# Altium schematic sheet Driver Borad.schdoc
size 292 x 204 mm
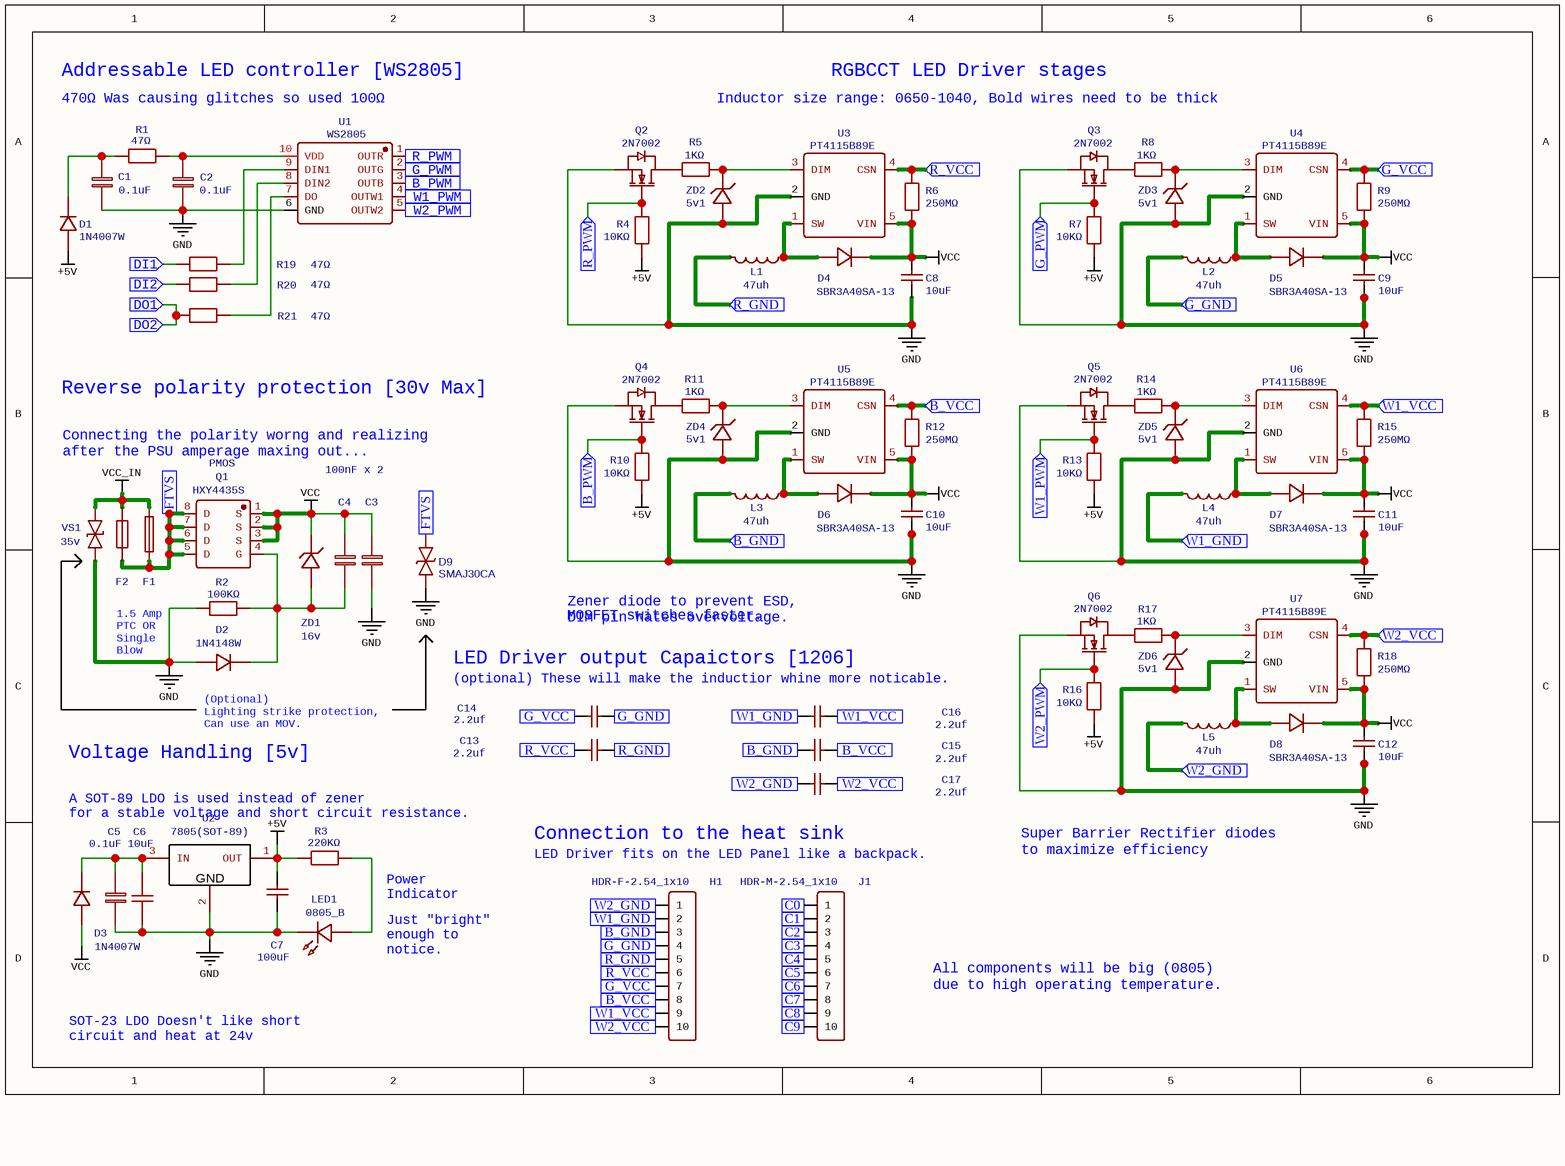
[diagram p0: Driver Borad.schdoc]

## Parts
C1  0.1uF  [C0805]
C2  0.1uF  [C0805]
C3  100nF  [C0805]  (value not drawn)
C4  100nF  [C0805]  (value not drawn)
C5  0.1uF  [C0805]
C6  10uF  [C1206]
C7  100uF  [C1206]
C8  10uF  [C1210]
C9  10uF  [C1210]
C10  10uF  [C1210]
C11  10uF  [C1210]
C12  10uF  [C1210]
C13  2.2uf  [C1206]
C14  2.2uf  [C1206]
C15  2.2uf  [C1206]
C16  2.2uf  [C1206]
C17  2.2uf  [C1206]
D1  1N4007W  [SOD-123_L2.8-W1.8-LS3.7-RD]
D2  1N4148W  [SOD-123FL_L2.6-W1.6-LS3.4-RD]
D3  1N4007W  [SOD-123_L2.8-W1.8-LS3.7-RD]
D4  SBR3A40SA-13  [SMA_L4.4-W2.8-LS5.4-RD]
D5  SBR3A40SA-13  [SMA_L4.4-W2.8-LS5.4-RD]
D6  SBR3A40SA-13  [SMA_L4.4-W2.8-LS5.4-RD]
D7  SBR3A40SA-13  [SMA_L4.4-W2.8-LS5.4-RD]
D8  SBR3A40SA-13  [SMA_L4.4-W2.8-LS5.4-RD]
D9  SMAJ30CA  [SMA_L4.4-W2.8-LS5.1-BI]
F1  3A PTC  [R1206]  (value not drawn)
F2  0ZCG0050FF2C  [F1812]  (value not drawn)
H1  HDR-F-2.54_1x10  [HDR-F-2.54_1X10]
J1  HDR-M-2.54_1x10  [HDR-M-2.54_1X10]
L1  47uh  [IND-SMD_L7.2-W6.6_GPSR07X0]
L2  47uh  [IND-SMD_L7.2-W6.6_GPSR07X0]
L3  47uh  [IND-SMD_L7.2-W6.6_GPSR07X0]
L4  47uh  [IND-SMD_L7.2-W6.6_GPSR07X0]
L5  47uh  [IND-SMD_L7.2-W6.6_GPSR07X0]
LED1  0805_B  [LED0805_BLUE]
Q1  HXY4435S  [SOP-8_L4.9-W3.9-P1.27-LS6.0-BL]
Q2  2N7002  [SOT-23_L2.9-W1.3-P0.95-LS2.4-BR]
Q3  2N7002  [SOT-23_L2.9-W1.3-P0.95-LS2.4-BR]
Q4  2N7002  [SOT-23_L2.9-W1.3-P0.95-LS2.4-BR]
Q5  2N7002  [SOT-23_L2.9-W1.3-P0.95-LS2.4-BR]
Q6  2N7002  [SOT-23_L2.9-W1.3-P0.95-LS2.4-BR]
R1  47Ω  [R0805]
R2  100KΩ  [R0805]
R3  220KΩ  [R0603]
R4  10KΩ  [R0805]
R5  1KΩ  [R0805]
R6  250MΩ  [R1206]
R7  10KΩ  [R0805]
R8  1KΩ  [R0805]
R9  250MΩ  [R1206]
R10  10KΩ  [R0805]
R11  1KΩ  [R0805]
R12  250MΩ  [R1206]
R13  10KΩ  [R0805]
R14  1KΩ  [R0805]
R15  250MΩ  [R1206]
R16  10KΩ  [R0805]
R17  1KΩ  [R0805]
R18  250MΩ  [R1206]
R19  47Ω  [R0805]
R20  47Ω  [R0805]
R21  47Ω  [R0805]
U1  WS2805  [SOP-10_L4.9-W3.9-P1.00-LS6.0-BL]
U2  7805(SOT-89)  [SOT-89-3_L4.5-W2.5-P1.50-LS4.2-BR]
U3  PT4115B89E  [SOT-89-5_L4.5-W2.5-P1.50-LS4.5-BR]
U4  PT4115B89E  [SOT-89-5_L4.5-W2.5-P1.50-LS4.5-BR]
U5  PT4115B89E  [SOT-89-5_L4.5-W2.5-P1.50-LS4.5-BR]
U6  PT4115B89E  [SOT-89-5_L4.5-W2.5-P1.50-LS4.5-BR]
U7  PT4115B89E  [SOT-89-5_L4.5-W2.5-P1.50-LS4.5-BR]
VS1  35v  [SMB_L4.6-W3.6-LS5.3-BI]
ZD1  16v  [SOD-123_L2.8-W1.8-LS3.7-RD]
ZD2  5v1  [SOD-123_L2.8-W1.8-LS3.7-RD]
ZD3  5v1  [SOD-123_L2.8-W1.8-LS3.7-RD]
ZD4  5v1  [SOD-123_L2.8-W1.8-LS3.7-RD]
ZD5  5v1  [SOD-123_L2.8-W1.8-LS3.7-RD]
ZD6  5v1  [SOD-123_L2.8-W1.8-LS3.7-RD]

## Ports
B_GND (in), B_PWM (in), B_VCC (in), C0 (in), C1 (in), C2 (in), C3 (in), C4 (in), C5 (in), C6 (in), C7 (in), C8 (in), C9 (in), DI1 (in), DI2 (in), DO1 (in), DO2 (in), FTVS (in), G_GND (in), G_PWM (in), G_VCC (in), R_GND (in), R_PWM (in), R_VCC (in), W1_GND (in), W1_PWM (in), W1_VCC (in), W2_GND (in), W2_PWM (in), W2_VCC (in)

## Nets
+5V: C7.2 D1.2 R3.1 R4.2 R7.2 R10.2 R13.2 R16.2 U2.1(OUT)
GND: C1.2 C2.2 C3.2 C5.2 C6.1 C7.1 C8.2 C9.2 C10.2 C11.2 C12.2 D2.2 D9.1 LED1.2 Q2.2(S) Q3.2(S) Q4.2(S) Q5.2(S) Q6.2(S) R2.1 U1.6(GND) U2.2(GND) U3.2(GND) U4.2(GND) U5.2(GND) U6.2(GND) U7.2(GND) VS1.1 ZD2.2(A) ZD3.2(A) ZD4.2(A) ZD5.2(A) ZD6.2(A)
VCC: C3.1 C4.1 C8.1 C9.1 C10.1 C11.1 C12.1 D3.2 D4.1(K) D5.1(K) D6.1(K) D7.1(K) D8.1(K) Q1.1(S) Q1.2(S) Q1.3(S) R6.2 R9.2 R12.2 R15.2 R18.2 U3.5(VIN) U4.5(VIN) U5.5(VIN) U6.5(VIN) U7.5(VIN) ZD1.1(C)
VCC_IN: F1.1 F2.2 VS1.2
B_GND: C15.2 H1.3 L3.2 ; port B_GND
B_PWM: Q4.1(G) R10.1 U1.3(OUTB) ; port B_PWM
B_VCC: C15.1 H1.8 R12.1 U5.4(CSN) ; port B_VCC
C0: J1.1 ; port C0
C1: J1.2 ; port C1
C2: J1.3 ; port C2
C3: J1.4 ; port C3
C4: J1.5 ; port C4
C5: J1.6 ; port C5
C6: J1.7 ; port C6
C7: J1.8 ; port C7
C8: J1.9 ; port C8
C9: J1.10 ; port C9
DI1: R19.2 ; port DI1
DI2: R20.2 ; port DI2
DO1: R21.2 ; port DO2, port DO1
FTVS: D9.2 F1.2 F2.1 Q1.5(D) Q1.6(D) Q1.7(D) Q1.8(D) ; port FTVS
G_GND: C14.1 H1.4 L2.2 ; port G_GND
G_PWM: Q3.1(G) R7.1 U1.2(OUTG) ; port G_PWM
G_VCC: C14.2 H1.7 R9.1 U4.4(CSN) ; port G_VCC
R_GND: C13.1 H1.5 L1.2 ; port R_GND
R_PWM: Q2.1(G) R4.1 U1.1(OUTR) ; port R_PWM
R_VCC: C13.2 H1.6 R6.1 U3.4(CSN) ; port R_VCC
W1_GND: C16.2 H1.2 L4.2 ; port W1_GND
W1_PWM: Q5.1(G) R13.1 U1.4(OUTW1) ; port W1_PWM
W1_VCC: C16.1 H1.9 R15.1 U6.4(CSN) ; port W1_VCC
W2_GND: C17.2 H1.1 L5.2 ; port W2_GND
W2_PWM: Q6.1(G) R16.1 U1.5(OUTW2) ; port W2_PWM
W2_VCC: C17.1 H1.10 R18.1 U7.4(CSN) ; port W2_VCC
NetC1_1: C1.1 D1.1 R1.1
NetC2_1: C2.1 R1.2 U1.10(VDD)
NetC4_2: C4.2 D2.1 Q1.4(G) R2.2 ZD1.2(A)
NetC5_1: C5.1 C6.2 D3.1 U2.3(IN)
NetD4_2: D4.2(A) L1.1 U3.1(SW)
NetD5_2: D5.2(A) L2.1 U4.1(SW)
NetD6_2: D6.2(A) L3.1 U5.1(SW)
NetD7_2: D7.2(A) L4.1 U6.1(SW)
NetD8_2: D8.2(A) L5.1 U7.1(SW)
NetLED1_1: LED1.1 R3.2
NetQ2_3: Q2.3(D) R5.1
NetQ3_3: Q3.3(D) R8.1
NetQ4_3: Q4.3(D) R11.1
NetQ5_3: Q5.3(D) R14.1
NetQ6_3: Q6.3(D) R17.1
NetR5_2: R5.2 U3.3(DIM) ZD2.1(C)
NetR8_2: R8.2 U4.3(DIM) ZD3.1(C)
NetR11_2: R11.2 U5.3(DIM) ZD4.1(C)
NetR14_2: R14.2 U6.3(DIM) ZD5.1(C)
NetR17_2: R17.2 U7.3(DIM) ZD6.1(C)
NetR19_1: R19.1 U1.9(DIN1)
NetR20_1: R20.1 U1.8(DIN2)
NetR21_1: R21.1 U1.7(DO)

## Notes on the sheet
- 470Ω Was causing glitches so used 100Ω
- Addressable LED controller [WS2805]
- Inductor size range: 0650-1040, Bold wires need to be thick
- RGBCCT LED Driver stages
- Connecting the polarity worng and realizing
  after the PSU amperage maxing out...
- Reverse polarity protection [30v Max]
- (near Q1) PMOS
- 100nF x 2
- 1.5 Amp
  PTC OR
  Single
  Blow
- MOSFET switches faster.
- (near C14) Zener diode to prevent ESD,
  DIM pin hates overvoltage.
- (Optional)
  Lighting strike protection,
  Can use an MOV.
- (optional) These will make the inductior whine more noticable.
- LED Driver output Capaictors [1206]
- Voltage Handling [5v]
- A SOT-89 LDO is used instead of zener
  for a stable voltage and short circuit resistance.
- Connection to the heat sink
- Super Barrier Rectifier diodes
  to maximize efficiency
- (near U2) GND
- Just "bright"
  enough to
  notice.
- Power
  Indicator
- LED Driver fits on the LED Panel like a backpack.
- All components will be big (0805)
  due to high operating temperature.
- SOT-23 LDO Doesn't like short
  circuit and heat at 24v

## Library data of the parts
C1 C2 C5 = 0.1uF: Manufacturer Part: CL21B104KCFNNNE; Manufacturer: SAMSUNG(三星); nameAlias: Value(F); Contributor: LCEDA_Lib; Supplier Part: C28233; Supplier: LCSC; spicePre: C; spiceSymbolName: C_0603_EU
C3 C4 = 100nF: Manufacturer Part: CL21B104KCFNNNE; Manufacturer: SAMSUNG(三星); nameAlias: Value(F); Contributor: LCEDA_Lib; Supplier Part: C28233; Supplier: LCSC; spicePre: C; spiceSymbolName: C_0603_EU
C6 = 10uF: Manufacturer: SAMSUNG(三星); Manufacturer Part: CL31A106KBHNNNE; nameAlias: Value; Supplier: LCSC; Supplier Part: C13585; JLCPCB Part Class: Extended Part; spicePre: C; spiceSymbolName: CL31B105KCHNNNE
C7 = 100uF: Manufacturer Part: CL31A106KBHNNNE; Manufacturer: SAMSUNG(三星); nameAlias: Value; Supplier: LCSC; Supplier Part: C13585; JLCPCB Part Class: Basic Part; link: https://lcsc.com/eda_search?q=C13585&%26type=1&ref=editor; spicePre: C; spiceSymbolName: CL31A106KBHNNNE
C8-C12 = 10uF: Manufacturer Part: CS3225X7R106K500NRL; Manufacturer: Samwha Capacitor; nameAlias: Value; Supplier: LCSC; Supplier Part: C2918502; JLCPCB Part Class: Extended Part; link: https://lcsc.com/eda_search?q=C13585&%26type=1&ref=editor; spicePre: C; spiceSymbolName: CL31A106KBHNNNE
C13-C17 = 2.2uf: Manufacturer Part: CL31A107MQHNNNE; Manufacturer: SAMSUNG(三星); nameAlias: Value; Supplier: LCSC; Supplier Part: C15008; JLCPCB Part Class: Basic Part; link: https://lcsc.com/eda_search?q=C13585&%26type=1&ref=editor; spicePre: C; spiceSymbolName: CL31A106KBHNNNE
D1 D3 = 1N4007W: Manufacturer: B ROCKET; Contributor: LCEDA_Lib; Supplier: LCSC; Supplier Part: C328592; Manufacturer Part: 1N4007W; spicePre: D; spiceSymbolName: 1N4007W
D2 = 1N4148W: Manufacturer: Tak Cheong; Contributor: LCEDA_Lib; Supplier: LCSC; Manufacturer Part: 1N4148W; Supplier Part: C129216; spicePre: D; spiceSymbolName: 1N4148W
D4-D8 = SBR3A40SA-13: Manufacturer: DIODES(美台); Supplier: LCSC; Manufacturer Part: SBR3A40SA-13; Supplier Part: C110516; JLCPCB Part Class: Extended Part; spicePre: D; spiceSymbolName: SBR3A40SA-13
D9 = SMAJ30CA: Manufacturer: GOODWORK(固得沃克); Contributor: LCSC; Supplier: LCSC; Supplier Part: C908828; Manufacturer Part: SMAJ30CA; JLCPCB Part Class: Extended Part; spicePre: D; spiceSymbolName: SMAJ30CA_C908828
F1 = 3A PTC: Manufacturer: TA-I Tech; Manufacturer Part: CFS12V3T3R00; Contributor: LCSC; Supplier: LCSC; Supplier Part: C163126; JLCPCB Part Class: Extended Part; spicePre: F; spiceSymbolName: 12H1300C
F2 = 0ZCG0050FF2C: Contributor: LCSC; Supplier: LCSC; Supplier Part: C9900006526; Manufacturer Part: 0ZCG0050FF2C; JLCPCB Part Class: Extended Part; spicePre: F; spiceSymbolName: 0ZCG0050FF2C
H1 = HDR-F-2.54_1x10: Contributor: LCEDA_Lib; Supplier Part: C35445; Supplier: LCSC; spicePre: H; spiceSymbolName: HDR-F-2.54_1x10
J1 = HDR-M-2.54_1x10: Contributor: LCEDA_Lib; Supplier Part: C57369; Supplier: LCSC; spicePre: J; spiceSymbolName: HDR-M-2.54_1x10
L1-L5 = 47uh: Manufacturer: cjiang(长江微电); Manufacturer Part: FXL0650-R68-M; nameAlias: Value; Contributor: lcsc; Supplier: LCSC; Supplier Part: C475519; JLCPCB Part Class: Extended Part; spicePre: L; spiceSymbolName: CYA0650-47UH
LED1 = 0805_B: Manufacturer: EVERLIGHT(台湾亿光); Manufacturer Part: 19-217/BHC-ZL1M2RY/3T; Contributor: LCEDA_01; Supplier Part: C72041; Supplier: LCSC; spicePre: L; spiceSymbolName: LED-0603_B
Q1 = HXY4435S: Manufacturer: HXY MOSFET(华轩阳电子); Contributor: lcsc; Supplier: LCSC; Supplier Part: C3033411; Manufacturer Part: HXY4435S; JLCPCB Part Class: Extended Part; spicePre: U; spiceSymbolName: HXY4435S
Q2-Q6 = 2N7002: Manufacturer: Nexperia; Manufacturer Part: 2N7002,215; Paste Type: expand; Contributor: LCEDA_Lib; Supplier: LCSC; image: //image.lceda.cn/szlcsc/C65189.jpg; Supplier Part: C65189; spicePre: Q; spiceSymbolName: 2N7002
R1 = 47Ω: Manufacturer Part: 0805W8J0103T5E; Manufacturer: UNI-ROYAL(Uniroyal Elec); nameAlias: Value(Ω); Contributor: LCEDA_Lib; Supplier Part: C25612; Supplier: LCSC; spicePre: R; spiceSymbolName: R_0603_EU
R2 = 100KΩ: Manufacturer Part: FRC0805J104 TS; Manufacturer: FOJAN(富捷); nameAlias: Value(Ω); Contributor: LCEDA_Lib; Supplier Part: C2907293; Supplier: LCSC; spicePre: R; spiceSymbolName: R_0603_EU
R3 = 220KΩ: Manufacturer Part: RC0603FR-07220KL; Manufacturer: YAGEO(国巨); nameAlias: Value(Ω); Contributor: LCEDA_Lib; Supplier Part: C123420; Supplier: LCSC; spicePre: R; spiceSymbolName: R_0402_EU
R4 R7 R10 R13 R16 = 10KΩ: Manufacturer Part: 0805W8J0103T5E; Manufacturer: UNI-ROYAL(Uniroyal Elec); nameAlias: Value(Ω); Contributor: LCEDA_Lib; Supplier Part: C25612; Supplier: LCSC; spicePre: R; spiceSymbolName: R_0603_EU
R5 R8 R11 R14 R17 = 1KΩ: Manufacturer Part: FRC0805J101 TS; Manufacturer: FOJAN; nameAlias: Value(Ω); Contributor: LCEDA_Lib; Supplier Part: C2907294; Supplier: LCSC; spicePre: R; spiceSymbolName: R_0603_EU
R6 R9 R12 R15 R18 = 250MΩ: Manufacturer Part: 1206W4J025KT5E; Manufacturer: UNI-ROYAL(厚声); nameAlias: Value(Ω); Contributor: LCEDA_Lib; Supplier Part: C247449; Supplier: LCSC; spicePre: R; spiceSymbolName: R_1206_EU
R19-R21 = 47Ω: Manufacturer Part: FRC0805J471 TS; Manufacturer: FOJAN; nameAlias: Value(Ω); Contributor: LCEDA_Lib; Supplier Part: C2907329; Supplier: LCSC; spicePre: R; spiceSymbolName: R_0603_EU
U1 = WS2805: Manufacturer: worldsemi; Contributor: lcsc; Supplier: LCSC; Supplier Part: C5446697; Manufacturer Part: WS2805; spicePre: U; spiceSymbolName: WS2805
U2 = 7805(SOT-89): Manufacturer: UMW(友台半导体); Manufacturer Part: 78L05; Contributor: LCEDA_Lib; Supplier: LCSC; Supplier Part: C347258; spicePre: U; spiceSymbolName: 7805(SOT-89)
U3-U7 = PT4115B89E: Manufacturer: PowTech(华润矽威); Contributor: hexawiz; Manufacturer Part: PT4115B89E; Supplier: LCSC; Supplier Part: C84512; spicePre: U; spiceSymbolName: PT4115B89E modded
VS1 = 35v: Manufacturer: LGE(鲁光); Manufacturer Part: P6SMB22CA; Contributor: LCSC; Supplier: LCSC; Supplier Part: C320520; JLCPCB Part Class: Extended Part; spicePre: D; spiceSymbolName: P6SMB22CA-C320520
ZD1 = 16v: Manufacturer: GOODWORK; Manufacturer Part: BZT52C16; Contributor: LCSC; Supplier: LCSC; Supplier Part: C2903915; JLCPCB Part Class: Extended Part; spicePre: D; spiceSymbolName: MMSZ4689_C184214
ZD2-ZD6 = 5v1: Manufacturer: 晶导微电子; Manufacturer Part: MM1W5V1; Contributor: LCSC; Supplier: LCSC; Supplier Part: C382836; JLCPCB Part Class: Extended Part; spicePre: D; spiceSymbolName: MMSZ4689_C184214